# EasyEDA schematic switch_2021-06-01.json
TITLE: Sheet_1; REV: 1.0; Date: 2021-05-30; Sheet: 1/1; Drawn By: lahiru_shyamal; Company: Your Company
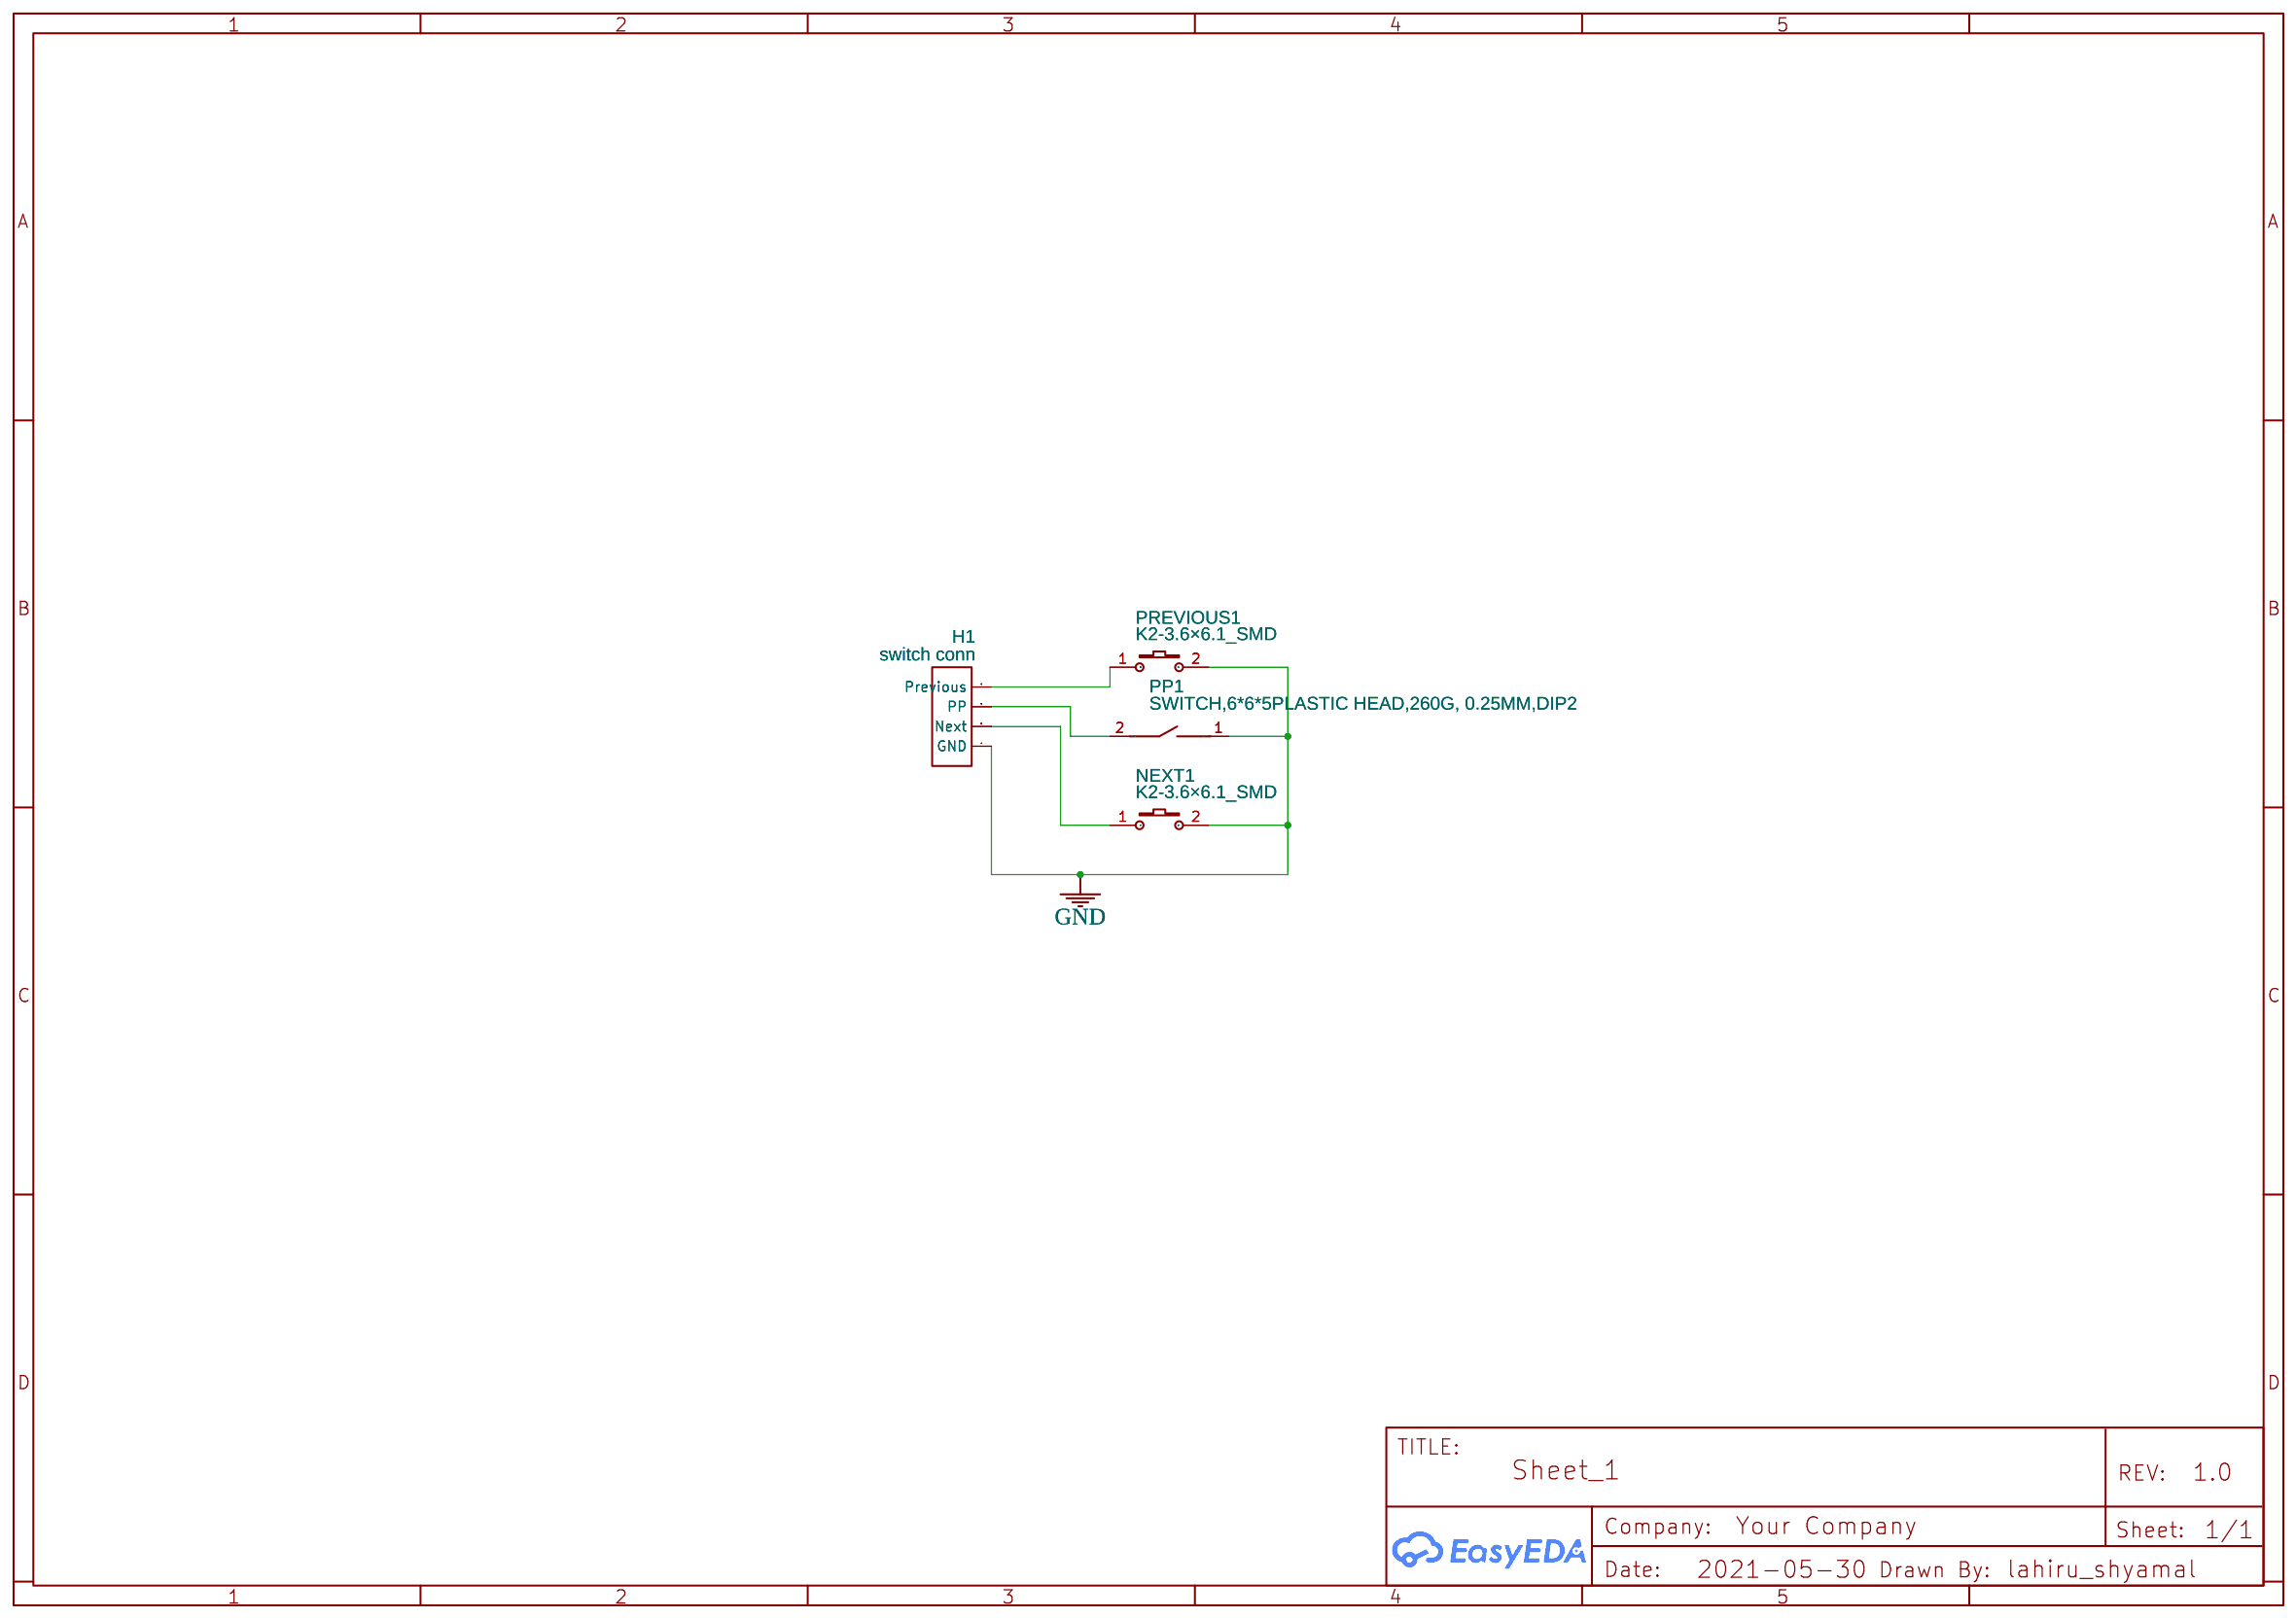
[diagram p0: schematic sheet]

## Parts
H1  switch conn  [HDR-F-2.54_1X4]
NEXT1  K2-3.6×6.1_SMD  [KEY-SMD_2P-L6.2-W3.6-LS8.0]
PP1  SWITCH,6*6*5PLASTIC HEAD,260G, 0.25MM,DIP2  [KEY-TH_2P-L6.0-W6.0-P5.00]
PREVIOUS1  K2-3.6×6.1_SMD  [KEY-SMD_2P-L6.2-W3.6-LS8.0]

## Library data of the parts
H1 = HDR-F-2.54_1x4: Supplier Part: C225501; Supplier: LCSC; Contributor: LCEDA_Lib
NEXT1 PREVIOUS1 = K2-3.6×6.1_SMD: Supplier Part: C118141; Supplier: LCSC; Manufacturer Part: K2-1107ST-A4SW-06; Contributor: LCEDA_Lib; 制造商: 韩国韩荣
PP1 = SWITCH,6*6*5PLASTIC HEAD,260G, 0.25MM,DIP2: Supplier: LCSC; Manufacturer: BBJ; Manufacturer Part: Switch,6*6*5Plastic head,260G, 0.25mm,DIP2; Contributor: LCSC; Supplier Part: C71845

## Nets
GND: H1.4(GND) NEXT1.2 PP1.1 PREVIOUS1.2
Net-(H1-1): H1.1(Previous) PREVIOUS1.1
Net-(H1-2): H1.2(PP) PP1.2
Net-(H1-3): H1.3(Next) NEXT1.1
